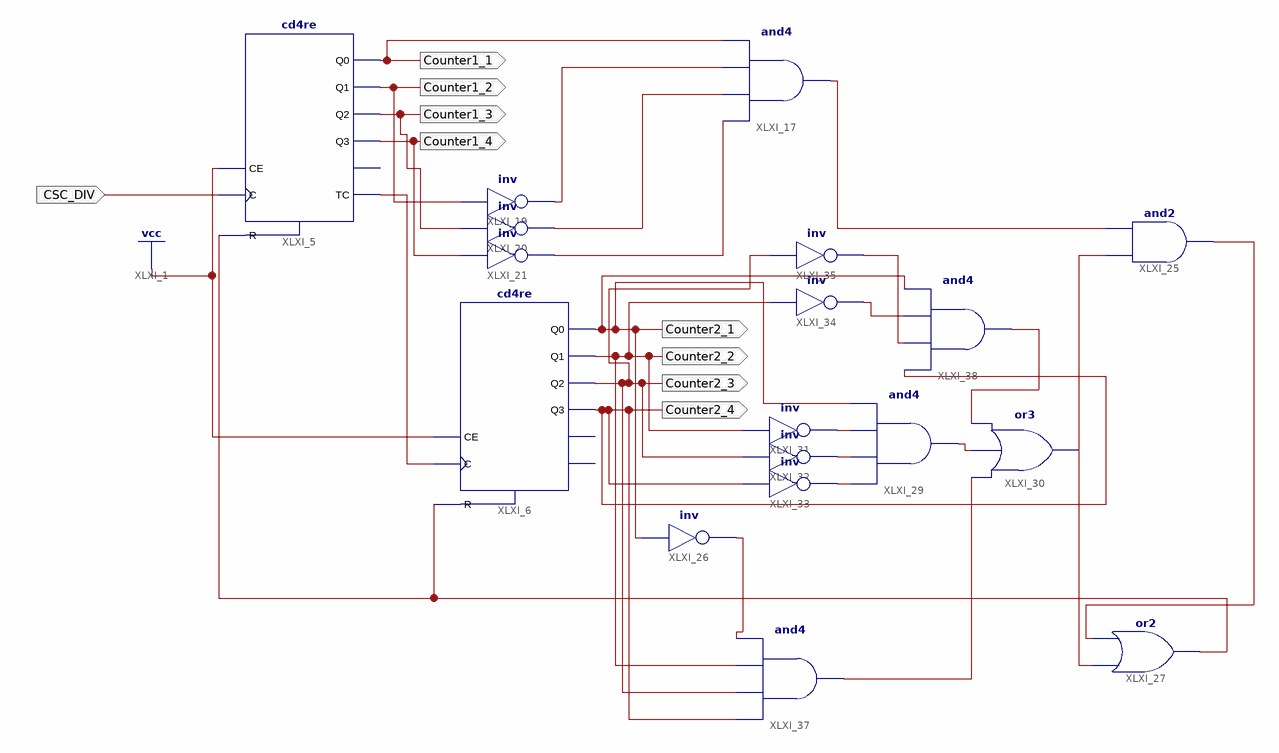
[diagram p0: schematic sheet 1]
// Xilinx ISE schematic Counter0_7.sch (spartan6) as structural Verilog: 18 symbols, 9 ports
module Counter0_7 (
  input  CSC_DIV,
  output Counter1_1,
  output Counter1_2,
  output Counter1_3,
  output Counter1_4,
  output Counter2_4,
  output Counter2_3,
  output Counter2_2,
  output Counter2_1
);

  wire XLXN_28, XLXN_46, XLXN_47, XLXN_48, XLXN_58, XLXN_72, XLXN_74, XLXN_77, XLXN_85, XLXN_86, XLXN_87,
       XLXN_101, XLXN_102, XLXN_103, XLXN_112, XLXN_113, XLXN_114;

  cd4re XLXI_5 (
    .C(CSC_DIV), .CE(1'b1), .R(XLXN_77), .Q0(Counter1_1), .Q1(Counter1_2), .Q2(Counter1_3), .Q3(Counter1_4),
    .TC(XLXN_28));  // open: CEO
  cd4re XLXI_6 (
    .C(XLXN_28), .CE(1'b1), .R(XLXN_77), .Q0(Counter2_1), .Q1(Counter2_2), .Q2(Counter2_3), .Q3(Counter2_4));  // open: CEO, TC
  and XLXI_17 (XLXN_58, XLXN_48, XLXN_47, XLXN_46, Counter1_1);
  not XLXI_19 (XLXN_46, Counter1_2);
  not XLXI_20 (XLXN_47, Counter1_3);
  not XLXI_21 (XLXN_48, Counter1_4);
  and XLXI_25 (XLXN_74, XLXN_112, XLXN_58);
  not XLXI_26 (XLXN_72, Counter2_1);
  or XLXI_27 (XLXN_77, XLXN_112, XLXN_74);
  and XLXI_29 (XLXN_85, XLXN_101, XLXN_87, XLXN_86, Counter2_1);
  or XLXI_30 (XLXN_112, XLXN_114, XLXN_85, XLXN_113);
  not XLXI_31 (XLXN_86, Counter2_2);
  not XLXI_32 (XLXN_87, Counter2_3);
  not XLXI_33 (XLXN_101, Counter2_4);
  not XLXI_34 (XLXN_102, Counter2_2);
  not XLXI_35 (XLXN_103, Counter2_3);
  and XLXI_37 (XLXN_114, Counter2_4, Counter2_3, Counter2_2, XLXN_72);
  and XLXI_38 (XLXN_113, Counter2_4, XLXN_103, XLXN_102, Counter2_1);
endmodule
